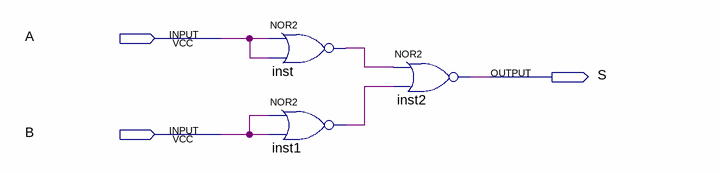
[diagram p0: schematic sheet]
// Quartus schematic nor_and.bdf as structural Verilog: 3 symbols, 3 pins
module nor_and (
  input  A,
  input  B,
  output S
);

  wire inst1_out, inst_out;

  nor inst (inst_out, A, A);
  nor inst1 (inst1_out, B, B);
  nor inst2 (S, inst_out, inst1_out);
endmodule
